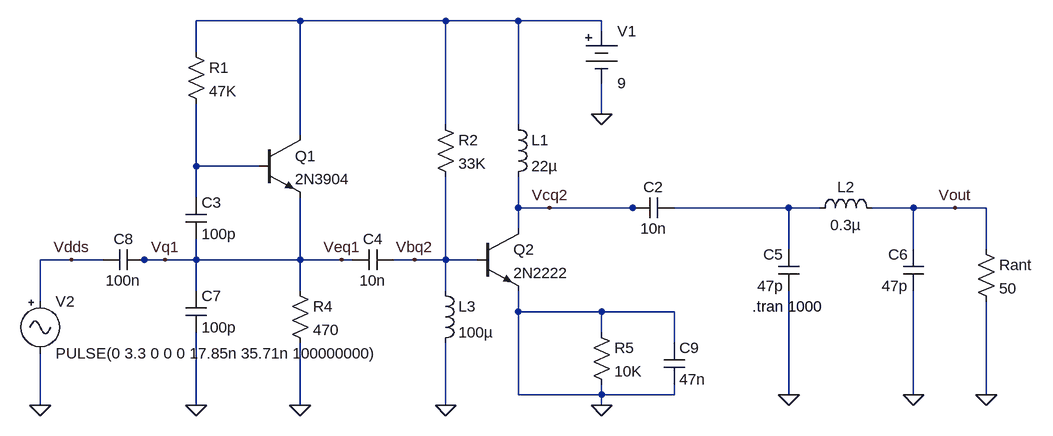
[diagram p0: schematic LTSpice_PixiePico_Design.asc]
LTSpice_PixiePico_Design.asc, the LTspice schematic file:
Version 4
SHEET 1 1144 680
WIRE 16 48 -144 48
WIRE 240 48 16 48
WIRE 352 48 240 48
WIRE 480 48 352 48
WIRE 480 64 480 48
WIRE -144 96 -144 48
WIRE 480 192 480 144
WIRE 240 208 240 48
WIRE 352 208 352 48
WIRE 16 224 16 48
WIRE -144 272 -144 176
WIRE -48 272 -144 272
WIRE -144 320 -144 272
WIRE 352 336 352 288
WIRE 400 336 352 336
WIRE 528 336 400 336
WIRE 544 336 528 336
WIRE 768 336 592 336
WIRE 816 336 768 336
WIRE 960 336 896 336
WIRE 1024 336 960 336
WIRE 1072 336 1024 336
WIRE 352 368 352 336
WIRE 768 400 768 336
WIRE 960 400 960 336
WIRE 1072 400 1072 336
WIRE -336 416 -384 416
WIRE -288 416 -336 416
WIRE -224 416 -240 416
WIRE -192 416 -224 416
WIRE -144 416 -144 384
WIRE -144 416 -192 416
WIRE 16 416 16 320
WIRE 16 416 -144 416
WIRE 80 416 16 416
WIRE 96 416 80 416
WIRE 192 416 160 416
WIRE 240 416 240 288
WIRE 240 416 192 416
WIRE 288 416 240 416
WIRE -144 464 -144 416
WIRE 16 464 16 416
WIRE 240 464 240 416
WIRE -384 480 -384 416
WIRE 352 496 352 464
WIRE 480 496 352 496
WIRE 592 496 480 496
WIRE 480 528 480 496
WIRE 592 544 592 496
WIRE 352 624 352 496
WIRE 480 624 480 608
WIRE 480 624 352 624
WIRE 592 624 592 608
WIRE 592 624 480 624
WIRE 768 624 768 464
WIRE 960 624 960 464
WIRE 1072 624 1072 480
WIRE -384 640 -384 560
WIRE -144 640 -144 528
WIRE 16 640 16 544
WIRE 240 640 240 544
WIRE 480 640 480 624
FLAG -144 640 0
FLAG 16 640 0
FLAG 480 640 0
FLAG 240 640 0
FLAG 768 624 0
FLAG 960 624 0
FLAG 1072 624 0
FLAG -384 640 0
FLAG 480 192 0
FLAG -336 416 Vdds
FLAG 1024 336 Vout
FLAG 80 416 Veq1
FLAG -192 416 Vq1
FLAG 192 416 Vbq2
FLAG 400 336 Vcq2
SYMBOL res -160 80 R0
SYMATTR InstName R1
SYMATTR Value 47K
SYMBOL res 0 448 R0
SYMATTR InstName R4
SYMATTR Value 470
SYMBOL res 224 192 R0
SYMATTR InstName R2
SYMATTR Value 33K
SYMBOL npn -48 224 R0
SYMATTR InstName Q1
SYMATTR Value 2N3904
SYMBOL cap -160 320 R0
SYMATTR InstName C3
SYMATTR Value 100p
SYMBOL cap -160 464 R0
SYMATTR InstName C7
SYMATTR Value 100p
SYMBOL cap 160 400 R90
WINDOW 0 0 32 VBottom 2
WINDOW 3 32 32 VTop 2
SYMATTR InstName C4
SYMATTR Value 10n
SYMBOL ind 224 448 R0
SYMATTR InstName L3
SYMATTR Value 100µ
SYMBOL ind 336 192 R0
SYMATTR InstName L1
SYMATTR Value 22µ
SYMBOL npn 288 368 R0
SYMATTR InstName Q2
SYMATTR Value 2N2222
SYMBOL res 464 512 R0
SYMATTR InstName R5
SYMATTR Value 10K
SYMBOL cap 576 544 R0
SYMATTR InstName C9
SYMATTR Value 47n
SYMBOL cap 592 320 R90
WINDOW 0 0 32 VBottom 2
WINDOW 3 32 32 VTop 2
SYMATTR InstName C2
SYMATTR Value 10n
SYMBOL cap 784 464 R180
WINDOW 0 24 56 Left 2
WINDOW 3 24 8 Left 2
SYMATTR InstName C5
SYMATTR Value 47p
SYMBOL cap 976 464 R180
WINDOW 0 24 56 Left 2
WINDOW 3 24 8 Left 2
SYMATTR InstName C6
SYMATTR Value 47p
SYMBOL Res 1056 384 R0
SYMATTR InstName Rant
SYMATTR Value 50
SYMBOL ind 800 352 R270
WINDOW 0 32 56 VTop 2
WINDOW 3 5 56 VBottom 2
SYMATTR InstName L2
SYMATTR Value 0.3µ
SYMBOL Misc/battery 480 48 R0
SYMATTR InstName V1
SYMATTR Value 9
SYMBOL Misc/signal -384 464 R0
SYMATTR InstName V2
SYMATTR Value PULSE(0 3.3 0 0 0 17.85n 35.71n 100000000)
SYMATTR Value2 AC 3.3
SYMBOL Cap -224 400 R90
WINDOW 0 0 32 VBottom 2
WINDOW 3 32 32 VTop 2
SYMATTR InstName C8
SYMATTR Value 100n
TEXT 712 488 Left 2 !.tran 1000

The netlist it stands for:
* LTSpice_PixiePico_Design.asc
R1 N001 N002 47K
R4 Vq1 0 470
R2 N001 Vbq2 33K
Q1 N001 N002 Vq1 0 2N3904
C3 N002 Vq1 100p
C7 Vq1 0 100p
C4 Vbq2 Vq1 10n
L3 Vbq2 0 100µ
L1 N001 Vcq2 22µ
Q2 Vcq2 Vbq2 0 0 2N2222
R5 0 0 10K
C9 0 0 47n
C2 N003 Vcq2 10n
C5 0 N003 47p
C6 0 Vout 47p
Rant Vout 0 50
L2 N003 Vout 0.3µ
V1 N001 0 9
V2 Vdds 0 PULSE(0 3.3 0 0 0 17.85n 35.71n 100000000) AC 3.3
C8 Vq1 Vdds 100n
.model NPN NPN
.model PNP PNP
.lib standard.bjt
.tran 1000
.backanno
.end